# EAGLE design star (EAGLE 9.6.2)
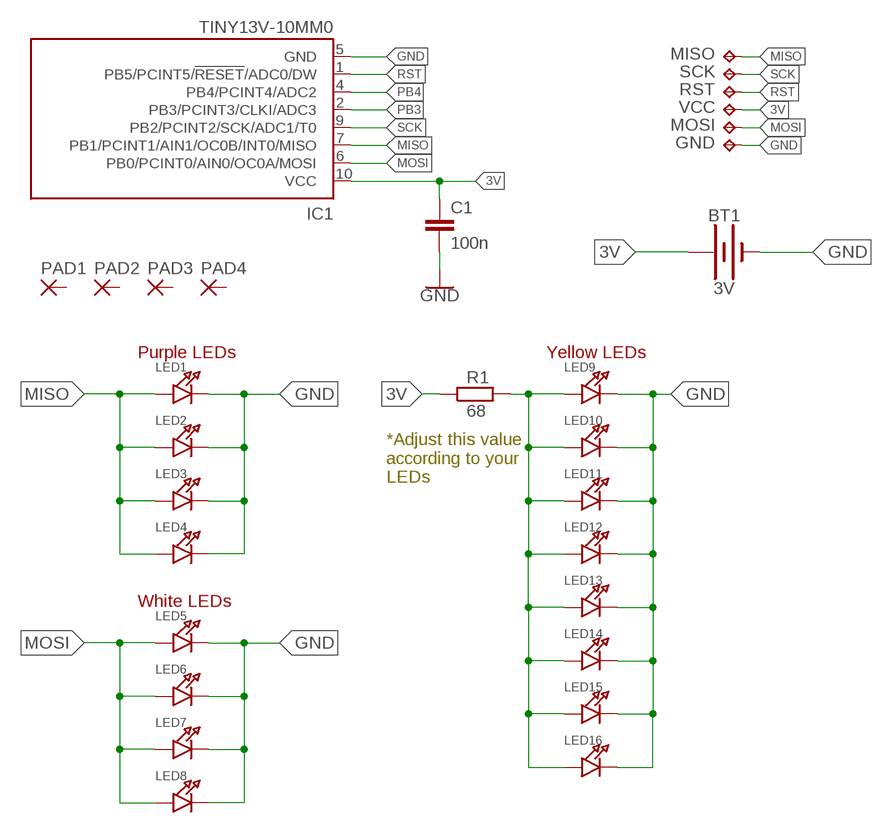
[diagram p0: schematic, sheet 1]

## Parts
BT1  3V  BATTERY-12MM_SMD  [BATTCON_12MM]
C1  100n  C-EUC0603K  [C0603K]
GND  TPB1,27  [B1,27]
IC1  TINY13V-10MM0  [10M1]
LED1  LED0603_NOOUTLINE  [CHIPLED_0603_NOOUTLINE]
LED2  LED0603_NOOUTLINE  [CHIPLED_0603_NOOUTLINE]
LED3  LED0603_NOOUTLINE  [CHIPLED_0603_NOOUTLINE]
LED4  LED0603_NOOUTLINE  [CHIPLED_0603_NOOUTLINE]
LED5  LED0603_NOOUTLINE  [CHIPLED_0603_NOOUTLINE]
LED6  LED0603_NOOUTLINE  [CHIPLED_0603_NOOUTLINE]
LED7  LED0603_NOOUTLINE  [CHIPLED_0603_NOOUTLINE]
LED8  LED0603_NOOUTLINE  [CHIPLED_0603_NOOUTLINE]
LED9  LED0603_NOOUTLINE  [CHIPLED_0603_NOOUTLINE]
LED10  LED0603_NOOUTLINE  [CHIPLED_0603_NOOUTLINE]
LED11  LED0603_NOOUTLINE  [CHIPLED_0603_NOOUTLINE]
LED12  LED0603_NOOUTLINE  [CHIPLED_0603_NOOUTLINE]
LED13  LED0603_NOOUTLINE  [CHIPLED_0603_NOOUTLINE]
LED14  LED0603_NOOUTLINE  [CHIPLED_0603_NOOUTLINE]
LED15  LED0603_NOOUTLINE  [CHIPLED_0603_NOOUTLINE]
LED16  LED0603_NOOUTLINE  [CHIPLED_0603_NOOUTLINE]
MISO  TPB1,27  [B1,27]
MOSI  TPB1,27  [B1,27]
PAD1  SMD2  [SMD1,27-2,54]
PAD2  SMD2  [SMD1,27-2,54]
PAD3  SMD2  [SMD1,27-2,54]
PAD4  SMD2  [SMD1,27-2,54]
R1  68  R-EU_R0603  [R0603]
RST  TPB1,27  [B1,27]
SCK  TPB1,27  [B1,27]
VCC  TPB1,27  [B1,27]

## Nets
3V: BT1.PWR@2(+) C1.1 IC1.10(VCC) R1.1 VCC.TP
GND: BT1.GND(-) C1.2 GND.TP IC1.5(GND) LED1.C LED2.C LED3.C LED4.C LED5.C LED6.C LED7.C LED8.C LED9.C LED10.C LED11.C LED12.C LED13.C LED14.C LED15.C LED16.C
MISO: IC1.7(PB1/PCINT1/AIN1/OC0B/INT0/MISO) LED1.A LED2.A LED3.A LED4.A MISO.TP
MOSI: IC1.6(PB0/PCINT0/AIN0/OC0A/MOSI) LED5.A LED6.A LED7.A LED8.A MOSI.TP
PB3: IC1.2(PB3/PCINT3/CLKI/ADC3)
PB4: IC1.4(PB4/PCINT4/ADC2)
RES: LED9.A LED10.A LED11.A LED12.A LED13.A LED14.A LED15.A LED16.A R1.2
RST: IC1.1(PB5/PCINT5/!RESET!/ADC0/DW) RST.TP
SCK: IC1.9(PB2/PCINT2/SCK/ADC1/T0) SCK.TP
Unconnected: PAD1.1(P) PAD2.1(P) PAD3.1(P) PAD4.1(P)

## Notes on the sheet
- Purple LEDs | Yellow LEDs
- *Adjust this value 
  according to your 
  LEDs
- White LEDs

## Power pins joined to a net without a drawn wire
GND: IC1.11(GND)

## Library data of the parts
BT1 = SparkFun-Batteries:BATTERY: Battery - Single Cell A variety of battery chemistries, sizes, and footprints. Device List: 20MM_PTH - Coin Cell Battery Holder - 20mm (PTH) <https://www.sparkfun.com/products/783> 20MM_PTH_KIT- Coin Cell battery Holder - 20 mm (PTH) <http://www.sparkfun.com/products/783>kit version with special mask 6.8MM_PTH - Coin Cell Battery Holder - 6.8MM(SMD) <https://www.digikey.com/product-detail/en/seiko-instruments/MS621FE-FL11E/728-1057-ND/1889208?WT.srch=1&gclid=CNOQ5a6LzdQCFZS2wAodXCkE0g> 12MM_SMD - Coin Cell Battery Holder - 12mm (SMD) <https://www.sparkfun.com/products/10592> 12MM_PTH - Coin Cell Battery Holder - 12mm (PTH) <https://www.sparkfun.com/products/7948> 20MM_SMD - 20mm Coin Cell Battery Holder (SMD) (2 legs) Used on the Big Time Watch Kit <https://www.sparkfun.com/products/11734> 20MM_SMD_4LEGS - Coin Cell Battery Holder - 20mm (SMD) <https://www.sparkfun.com/products/11892> 20MM_SMD_4LEGS_OVERPASTE - Coin Cell Battery Holder - 20mm (SMD) <https://www.sparkfun.com/products/11892> (Over-paste on the legs) 24.5MM_PTH - Coin Cell Battery Holder - 24.5mm (PTH) <https://www.sparkfun.com/products/8863> 9V - 9V Battery Holder - PC Mount Used on the SparkFun SparkPunk Sound Kit <https://www.sparkfun.com/products/11177> and SparkFun SparkPunk Sequencer Kit <https://www.sparkfun.com/products/12707> 18650 - Battery Holder - 18650 (PTH) <https://www.sparkfun.com/products/13113> AA - Battery Holder - 1xAA (PTH) <https://www.sparkfun.com/products/7949> AAA - Battery Holder - 1xAAA (PTH) <https://www.sparkfun.com/products/12718> AA_KIT - Battery Holder - 1xAA (PTH) <https://www.sparkfun.com/products/7949> Special kit package - pads only have exposed copper on one side of the board. AAA_KIT - Battery Holder - 1xAAA (PTH) <https://www.sparkfun.com/products/12718> Special kit package - pads only have exposed copper on one side of the board.; PROD_ID: BATT-08044; SF_SKU: PRT-10592
C1 = rcl:C-EU: CAPACITOR, European symbol; SPICEPREFIX: C
GND MISO MOSI RST SCK VCC = testpad:TP: Test pad
IC1 = atmel:TINY13*: 8-bit AVR Microcontroller with 1K Bytes In-System Programmable Flash Source: http://www.atmel.com/dyn/resources/prod_documents/2535S.pdf; MPN: ATTINY13A-MMU; OC_FARNELL: 1715516; OC_NEWARK: 15R0298
LED1-LED16 = microbuilder:LED: LED 0603 - 0603 Surface Mount Package 2mA: Green LED - Low Power (3.9mcd, 2ma, 1.7Vf) - Digikey: 475-2709-2-ND Orange LED - Low Power (9.8mcd, 2ma, 1.8Vf) - Digikey: 475-1194-2-ND Red LED - Low Power (5mcd, 2ma, 1.8Vf) - Digikey: 475-1195-2-ND Yellow LED - Low Power (7mcd, 2ma, 1.8Vf) - Digikey: 475-1196-2-ND 5mA: Blue LED - Low Power (17mcd, 5ma, 2.9Vf) - Digikey: LNJ937W8CRACT-ND 0805 - 0805 Surface Mount Package 2mA: Red LED (8.8mcd, 2mA, 1.8Vf, Clear) - Low Power [Digikey: 475-2510-1-ND] Green LED (5mcd, 2mA, 1.8Vf, Clear) - Low Power [Digikey: 475-2730-1-ND] Yellow LED (11.3mcd, 2mA, 1.8Vf, Clear) - Low Power [Digikey: 475-2555-1-ND] 20mA: Red LED (104mcd, 20mA, Diffused) - LS R976 [Digikey: 475-1278-6-ND] Red LED (12mcd, 20mA, 2.0Vf, Clear) - APT2012EC [Digikey: 754-1128-1-ND] Green LED (15mcd, 20mA, 2.2Vf, Clear) - APT2012GC [Digikey: 754-1131-1-ND] Orange LED (160mcd, 20mA, 2.1Vf, Clear) - APT2012SECK [Digikey: 754-1130-1-ND] 1206 - 1206 Surface Mount Package Green LED (26mcd, 20mA, Diffused) - LG N971 [Digikey: 475-1407-6-ND] Red LED (15mcd, 20mA, Diffused) - LH N974 [Digikey: 475-1416-6-ND]
PAD1-PAD4 = wirepad:SMD2: SMD PAD
R1 = rcl:R-EU_: RESISTOR, European symbol; SPICEPREFIX: R

## Net classes
0 default: width 0.254 mm

## Board
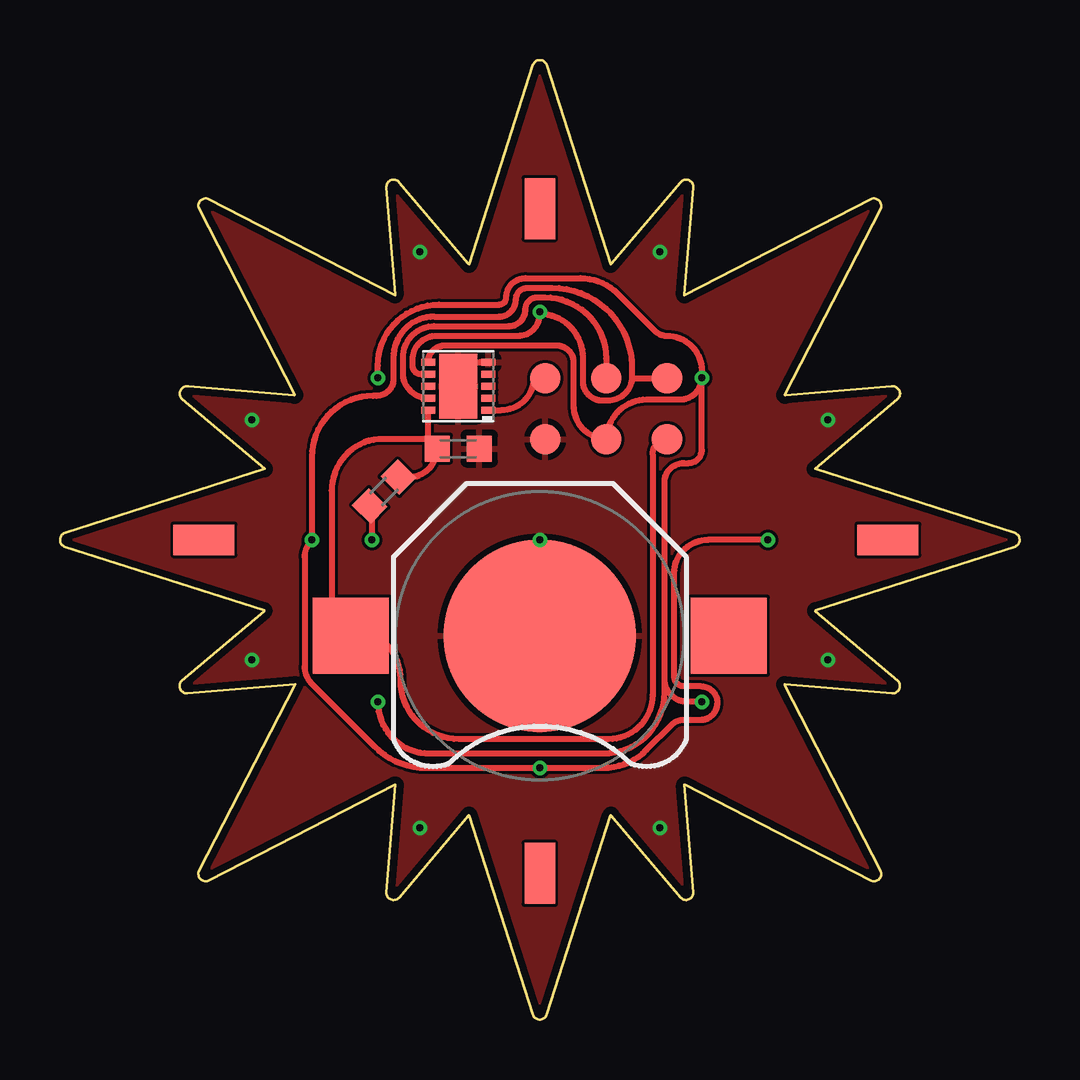
[diagram p1: board, top side]
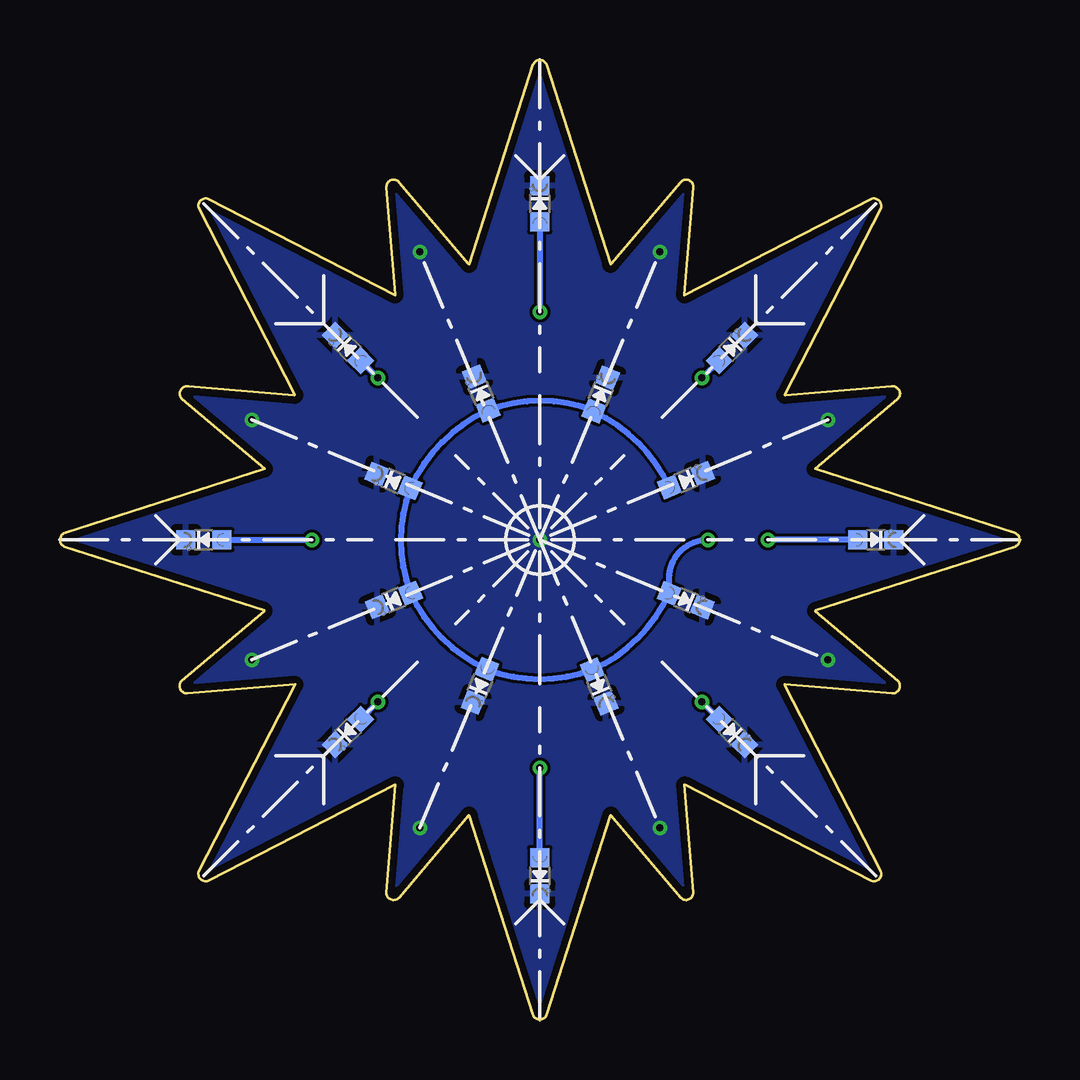
[diagram p2: board, bottom side, seen from below]

Size 39.98 x 39.98 mm. Coordinates in mm from the lower left corner, seen from the top.
Outline: 19.99,39.98 19.94,39.98 19.89,39.97 19.84,39.94 19.8,39.91 19.76,39.88 19.73,39.83 19.71,39.78 17.05,31.47 17.02,31.49 14.14,34.88 14.11,34.92 14.07,34.95 14.02,34.98 13.97,34.99 13.92,35 13.87,35 13.81,34.99 13.76,34.97 13.72,34.94 13.68,34.9 13.65,34.86 13.62,34.82 13.61,34.77 13.6,34.71 13.6,34.66 13.97,30.23 13.97,30.19 6.2,34.19 6.15,34.2 6.1,34.22 6.05,34.22 6,34.21 5.95,34.19 5.9,34.17 5.86,34.13 5.83,34.09 5.8,34.05 5.78,34 5.77,33.95 5.77,33.89 5.78,33.84 5.79,33.79 9.79,26.03 9.77,26.01 5.34,26.38 5.28,26.38 5.23,26.38 5.18,26.37 5.13,26.34 5.09,26.31 5.05,26.27 5.02,26.23 5,26.18 4.99,26.13 4.98,26.08 4.99,26.03 5,25.98 5.03,25.93 5.06,25.89 5.1,25.85 8.53,22.94 0.21,20.28 0.16,20.26 0.12,20.23 0.08,20.2 0.05,20.15 0.02,20.11 0.01,20.06 0,20 0,19.95 0.01,19.9 0.03,19.85 0.06,19.81 0.1,19.77 0.14,19.74 0.19,19.71 8.5,17.05 8.51,17.02 5.08,14.12 5.04,14.08 5.01,14.03 5,13.98 4.99,13.93 4.99,13.88 4.99,13.83 5.01,13.78 5.04,13.73 5.07,13.69 5.11,13.65 5.16,13.63 5.21,13.61 5.26,13.6 5.31,13.6 9.79,13.97 9.78,13.93 5.8,6.21 5.78,6.17 5.77,6.11 5.77,6.06 5.77,6.01 5.79,5.96 5.81,5.91 5.84,5.87 5.88,5.83 5.92,5.8 5.97,5.78 6.02,5.77 6.08,5.77 6.13,5.77 6.18,5.79 6.23,5.81 13.94,9.78 13.97,9.78 13.6,5.3 13.6,5.24 13.61,5.19 13.63,5.14 13.66,5.1 13.7,5.06 13.74,5.03 13.79,5.01 13.84,4.99 13.89,4.98 13.94,4.99 14,5 14.04,5.02 14.09,5.05 14.13,5.09 17.03,8.52 17.05,8.49 19.7,0.22 19.72,0.17 19.74,0.13 19.78,0.09 19.82,0.05 19.86,0.03 19.91,0.01 19.97,0 20.02,0 20.07,0.01 20.12,0.03 20.17,0.05 20.21,0.09 20.24,0.13 20.27,0.17 20.28,0.22 22.93,8.49 22.95,8.52 25.86,5.09 25.9,5.05 25.94,5.02 25.99,5 26.04,4.99 26.09,4.98 26.15,4.99 26.2,5.01 26.24,5.03 26.29,5.06 26.32,5.1 26.35,5.14 26.37,5.19 26.38,5.24 26.39,5.3 26.01,9.78 26.04,9.78 33.76,5.81 33.81,5.79 33.86,5.77 33.91,5.77 33.96,5.77 34.01,5.78 34.06,5.8 34.1,5.83 34.14,5.87 34.17,5.91 34.2,5.96 34.21,6.01 34.22,6.06 34.22,6.11 34.2,6.17 34.18,6.21 30.21,13.93 30.19,13.97 34.67,13.6 34.73,13.6 34.78,13.61 34.83,13.63 34.87,13.65 34.91,13.69 34.95,13.73 34.97,13.78 34.99,13.83 35,13.88 35,13.93 34.99,13.98 34.97,14.03 34.94,14.08 34.91,14.12 31.48,17.02 31.48,17.05 39.8,19.71 39.85,19.74 39.89,19.77 39.92,19.81 39.95,19.85 39.97,19.9 39.98,19.95 39.98,20 39.98,20.06 39.96,20.11 39.94,20.15 39.91,20.2 39.87,20.23 39.82,20.26 39.77,20.28 31.46,22.94 34.89,25.85 34.93,25.89 34.96,25.93 34.98,25.98 35,26.03 35,26.08 35,26.13 34.98,26.18 34.96,26.23 34.93,26.27 34.89,26.31 34.85,26.34 34.8,26.37 34.75,26.38 34.7,26.38 34.65,26.38 30.22,26.01 30.2,26.03 34.19,33.79 34.21,33.84 34.22,33.89 34.22,33.95 34.21,34 34.19,34.05 34.16,34.09 34.12,34.13 34.08,34.17 34.04,34.19 33.99,34.21 33.94,34.22 33.88,34.22 33.83,34.2 33.78,34.19 26.02,30.19 26.02,30.23 26.38,34.66 26.39,34.71 26.38,34.77 26.36,34.82 26.34,34.86 26.3,34.9 26.27,34.94 26.22,34.97 26.17,34.99 26.12,35 26.07,35 26.01,34.99 25.96,34.98 25.92,34.95 25.88,34.92 25.84,34.88 22.97,31.49 22.94,31.47 20.28,39.78 20.25,39.83 20.22,39.88 20.19,39.91 20.14,39.94 20.1,39.97 20.05,39.98 19.99,39.98
Copper layers (1*16): Top 0.035mm / dielectric 1.6mm / Bottom 0.035mm
Design rules "jlcpcb-2layers *": minimum track width 5mil, minimum drill 0.3mm, track to track 5mil, track to pad 5mil, pad to pad 5mil, via to via 5mil, smd to smd 5mil, copper to edge 0.3mm, drill to drill 6mil, minimum pad ring 10mil, minimum via ring 3mil, stop-mask expansion 4mil, vias tented up to drill 0mil, thermal gap 10mil

### Footprints (pad centres in the part's own frame; a part is rotated, then mirrored left to right if it is on the bottom)
BATTCON_12MM = smd 8 x 8: GND 0,0 | smd 3.175 x 3.175: PWR@1 -7.874,0; PWR@2 7.874,0
C0603K = smd 1.05 x 1.08: 1 -0.875,0; 2 0.875,0
B1,27 = smd 1.27 x 1.27: TP 0,0
10M1 = smd 0.6 x 0.3: 1 -1.25,1; 2 -1.25,0.5; 3 -1.25,0; 4 -1.25,-0.5; 5 -1.25,-1; 6 1.25,-1; 7 1.25,-0.5; 8 1.25,0; 9 1.25,0.5; 10 1.25,1 | smd 1.6 x 2.7: 11 0,0
CHIPLED_0603_NOOUTLINE = smd 0.8 x 0.8: A 0,-0.75; C 0,0.75
SMD1,27-2,54 = smd 1.27 x 2.54: 1 0,0
R0603 = smd 1 x 1.1: 1 -0.85,0; 2 0.85,0

### Placement (x,y rotation side)
BT1  19.99,15.99 180 top
C1  16.59,23.79 0 top
GND  20.21,24.19 270 top
IC1  16.59,26.39 180 top
LED1  19.99,33.99 0 bottom
LED2  33.99,19.99 90 bottom
LED3  19.99,5.99 180 bottom
LED4  5.99,19.99 270 bottom
LED5  27.99,27.99 45 bottom
LED6  27.99,11.99 135 bottom
LED7  11.99,11.99 225 bottom
LED8  11.99,27.99 315 bottom
LED9  13.91,17.47 247.5 bottom
LED10  13.9,22.47 292.5 bottom
LED11  22.43,26.09 22.5 bottom
LED12  17.45,26.05 337.5 bottom
LED13  17.52,13.88 202.5 bottom
LED14  26.07,17.48 112.5 bottom
LED15  26.09,22.44 67.5 bottom
LED16  22.48,13.91 157.5 bottom
MISO  25.29,26.73 270 top
MOSI  22.75,24.19 270 top
PAD1  19.99,33.79 0 top
PAD2  19.99,6.09 0 top
PAD3  34.49,19.99 90 top
PAD4  5.99,19.99 90 top
R1  13.5,22 225 top
RST  20.21,26.73 270 top
SCK  22.75,26.73 270 top
VCC  25.29,24.19 270 top

### Tracks (layer width: path | path; a pad name or v marks a point on that pad's centre or on a via)
3V
  Top 0.254: VCC.TP 25.33,24.19 arc90 24.69,23.56 24.69,13.53 arc-90 22.85,11.69 16.63,11.69 arc-90 14.19,14.13 14.19,14.19 arc90 12.14,16.24 BT1.PWR@2 11.32,17.29 11.32,22.05 arc-90 13.46,24.19 15.32,24.19 C1.1 | C1.1 arc-90 15.34,24.17 IC1.10 | R1.1 14.53,22.6 arc90 C1.1
GND  (via drill 0.3 pad 0.6)
  Top 0.254: IC1.5 17.59,27.39 arc90 IC1.11
  other vias: 7.99,24.99 14.99,31.99 24.99,31.99 31.99,24.99 31.99,14.99 24.99,7.99 14.99,7.99 7.99,14.99 19.99,19.99
  pour Top: -0.01,-0.01 39.99,-0.01 39.99,39.99 -0.01,39.99
  pour Bottom: -0.01,-0.01 39.99,-0.01 39.99,39.99 -0.01,39.99
MISO  (via drill 0.3 pad 0.6)
  Top 0.254: 19.99,29.39 v19.99,29.49 | IC1.7 15.04,26.89 arc-90 14.69,27.24 14.69,27.49 arc-90 15.69,28.49 19.09,28.49 arc90 19.99,29.39 | MISO.TP 23.83,26.73 23.83,26.79 | 23.83,26.79 23.83,27.15 arc90 20.49,30.49 19.49,30.49 arc90 18.99,29.99 arc-90 18.29,29.29 15.59,29.29 arc90 13.89,27.59 13.89,26.69 arc-90 13.19,25.99 13.03,25.99 arc90 10.49,23.45 v10.49,19.99 arc45 10.19,19.27 10.19,14.72 arc45 10.49,13.99 13.11,11.38 arc45 15.24,10.49 v19.99,10.49 22.64,10.49 arc45 24.44,11.24 25.49,12.29 arc-45 25.98,12.49 26.69,12.49 arc90 27.39,13.19 arc90 26.69,13.89 25.99,13.89 arc-90 25.59,14.29 25.59,18.59 arc-90 26.99,19.99 v29.49,19.99 | 23.83,26.79 arc-90 22.83,25.79 22.59,25.79 arc-90 21.79,26.59 21.79,27.59 arc90 19.99,29.39
  Bottom 0.254: LED4.A v10.49,19.99 | LED1.A v19.99,29.49 | LED2.A v29.49,19.99 | LED3.A v19.99,10.49
MOSI  (via drill 0.3 pad 0.6)
  Top 0.254: MOSI.TP 22.79,24.19 | IC1.6 arc-90 16.04,28.09 20.69,28.09 arc-90 21.39,27.39 21.39,25.59 arc90 22.79,24.19 | 22.79,24.19 arc-90 24.44,25.84 25.84,25.84 arc90 v26.74,26.74 | v13.24,26.74 13.24,27.25 arc-90 15.78,29.79 18.29,29.79 arc90 18.59,30.09 arc-90 19.39,30.89 21.69,30.89 arc-45 23.23,30.26 24.78,28.7 arc45 25.29,28.49 arc-90 26.74,27.04 v26.74,26.74 | v13.24,13.24 arc90 15.39,11.09 22.65,11.09 arc90 25.19,13.63 25.19,14.19 | v26.74,13.24 26.14,13.24 arc-90 25.19,14.19 | 25.19,14.19 25.19,22.39 arc-90 25.99,23.19 26.19,23.19 arc90 26.74,23.74 v26.74,26.74
  Bottom 0.254: v13.24,13.24 | LED5.A | LED6.A v26.74,13.24 | LED7.A v13.24,13.24 | LED8.A v13.24,26.74 | v26.74,26.74 LED5.A
RES  (via drill 0.3 pad 0.6)
  Top 0.254: R1.2 arc-90 12.99,21.31 v12.99,19.99
  Bottom 0.254: LED10.A arc-40 17.74,25.33 LED12.A 17.78,25.4 arc-40 LED11.A 22.16,25.4 arc-40 LED15.A arc-40 25.4,17.79 LED14.A arc-40 22.22,14.6 LED16.A 22.17,14.57 arc-40 LED13.A 17.79,14.57 arc-40 LED9.A 14.61,18.38 arc90 v12.99,19.99
RST
  Top 0.254: IC1.1 18.39,25.39 arc90 19.73,26.73 RST.TP
SCK
  Top 0.254: IC1.9 arc-90 14.29,26.94 14.29,27.59 arc-90 15.59,28.89 18.69,28.89 arc90 19.39,29.59 arc-90 19.89,30.09 19.99,30.09 20.09,30.09 20.21,30.09 arc-90 22.75,27.55 SCK.TP